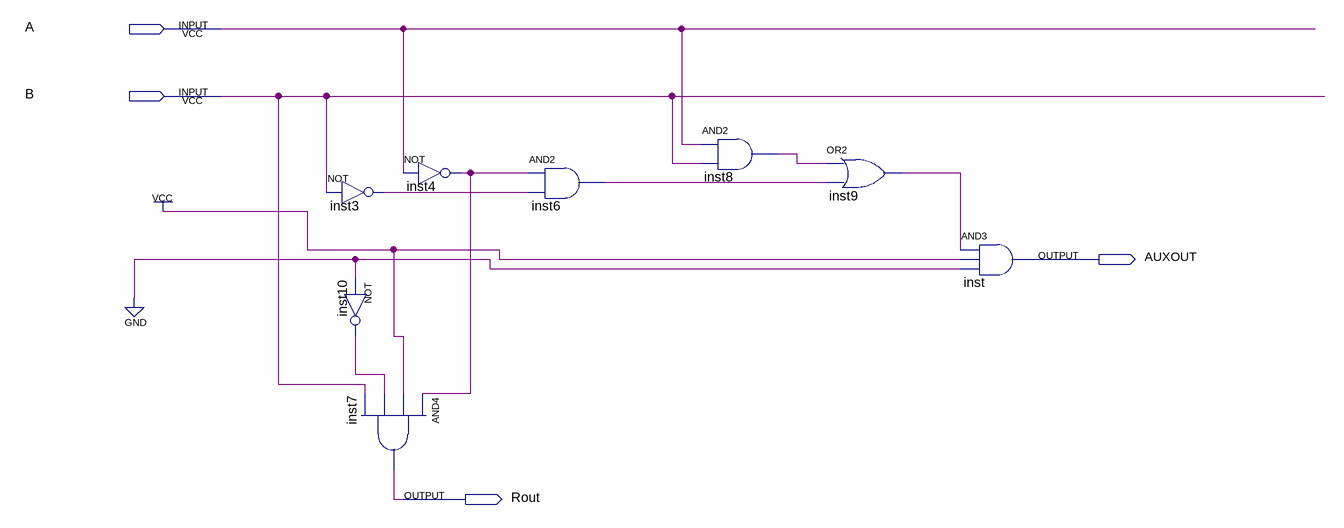
[diagram p0: schematic sheet]
// Quartus schematic MairMenorSpecialBlock.bdf as structural Verilog: 8 symbols, 4 pins
module MairMenorSpecialBlock (
  input  A,
  input  B,
  output AUXOUT,
  output Rout
);

  wire inst3_out, inst4_out, inst6_out, inst8_out, inst9_out, inst10_out;

  not inst3 (inst3_out, B);
  not inst10 (inst10_out, 1'b0);
  not inst4 (inst4_out, A);
  and inst7 (Rout, inst4_out, 1'b1, inst10_out, B);
  and inst6 (inst6_out, inst4_out, inst3_out);
  and inst8 (inst8_out, A, B);
  or inst9 (inst9_out, inst8_out, inst6_out);
  and inst (AUXOUT, inst9_out, 1'b1, 1'b0);
endmodule
